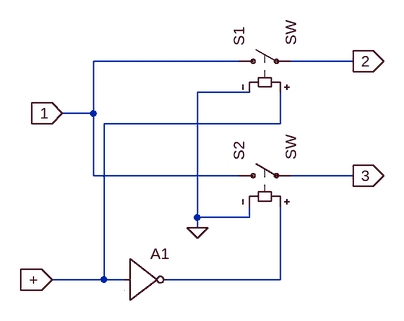
[diagram p0: schematic Draft3.asc]
Draft3.asc, the LTspice schematic file:
Version 4
SHEET 1 880 680
WIRE 160 96 -64 96
WIRE 336 96 240 96
WIRE 176 144 96 144
WIRE -64 176 -64 96
WIRE -64 176 -112 176
WIRE 224 192 224 144
WIRE 224 192 -48 192
WIRE -64 272 -64 176
WIRE 160 272 -64 272
WIRE 336 272 240 272
WIRE 96 336 96 144
WIRE 176 336 176 320
WIRE 176 336 96 336
WIRE 96 352 96 336
WIRE -48 432 -48 192
WIRE -48 432 -128 432
WIRE -16 432 -48 432
WIRE 224 432 224 320
WIRE 224 432 48 432
FLAG -112 176 1
IOPIN -112 176 In
FLAG 336 96 2
IOPIN 336 96 Out
FLAG 336 272 3
IOPIN 336 272 Out
FLAG 96 352 0
FLAG -128 432 +
IOPIN -128 432 In
SYMBOL sw 144 96 R270
SYMATTR InstName S1
SYMBOL sw 144 272 R270
SYMATTR InstName S2
SYMBOL Digital\\inv -16 368 R0
SYMATTR InstName A1

The netlist it stands for:
* Draft3.asc
S1 1 2 + 0 SW
S2 1 3 N001 0 SW
A1 + 0 0 0 0 N001 0 0 BUF
.backanno
.end